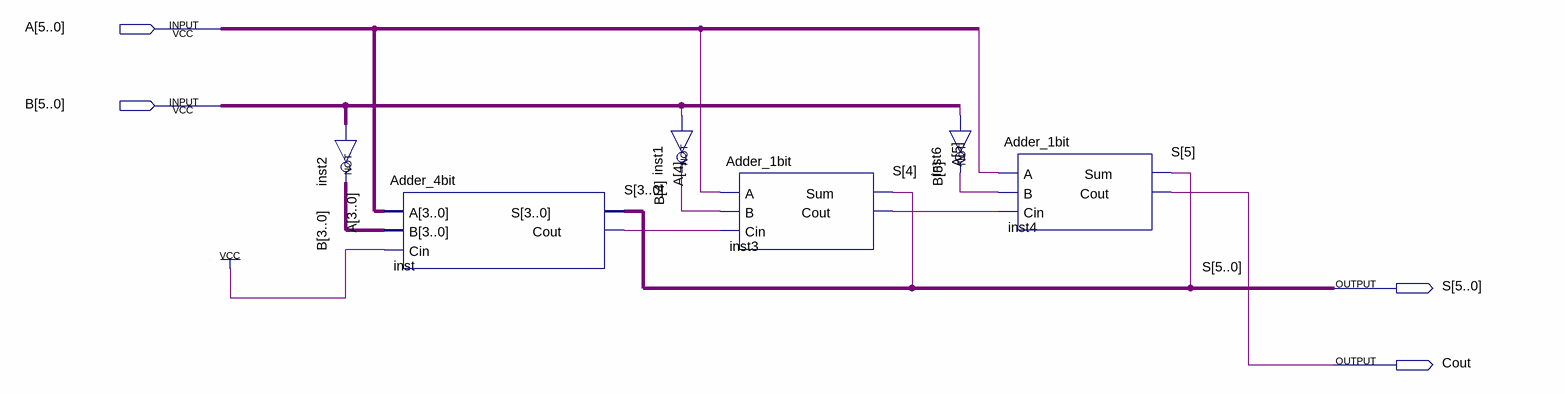
[diagram p0: schematic sheet]
// Quartus schematic Sub_6bit.bdf as structural Verilog: 6 symbols, 4 pins
module Sub_6bit (
  input  [5:0] A,
  input  [5:0] B,
  output [5:0] S,
  output Cout
);

  wire inst1_out, inst3_cout, inst6_out, inst_cout;
  wire [3:0] inst2_out;

  assign inst2_out = ~B[3:0];  // NOT inst2, 4 bits wide
  Adder_4bit inst (.A(A[3:0]), .B(inst2_out), .Cin(1'b1), .S(S[3:0]), .Cout(inst_cout));
  not inst1 (inst1_out, B[4]);
  Adder_1bit inst3 (.A(A[4]), .B(inst1_out), .Cin(inst_cout), .Sum(S[4]), .Cout(inst3_cout));
  not inst6 (inst6_out, B[5]);
  Adder_1bit inst4 (.A(A[5]), .B(inst6_out), .Cin(inst3_cout), .Sum(S[5]), .Cout(Cout));
endmodule
